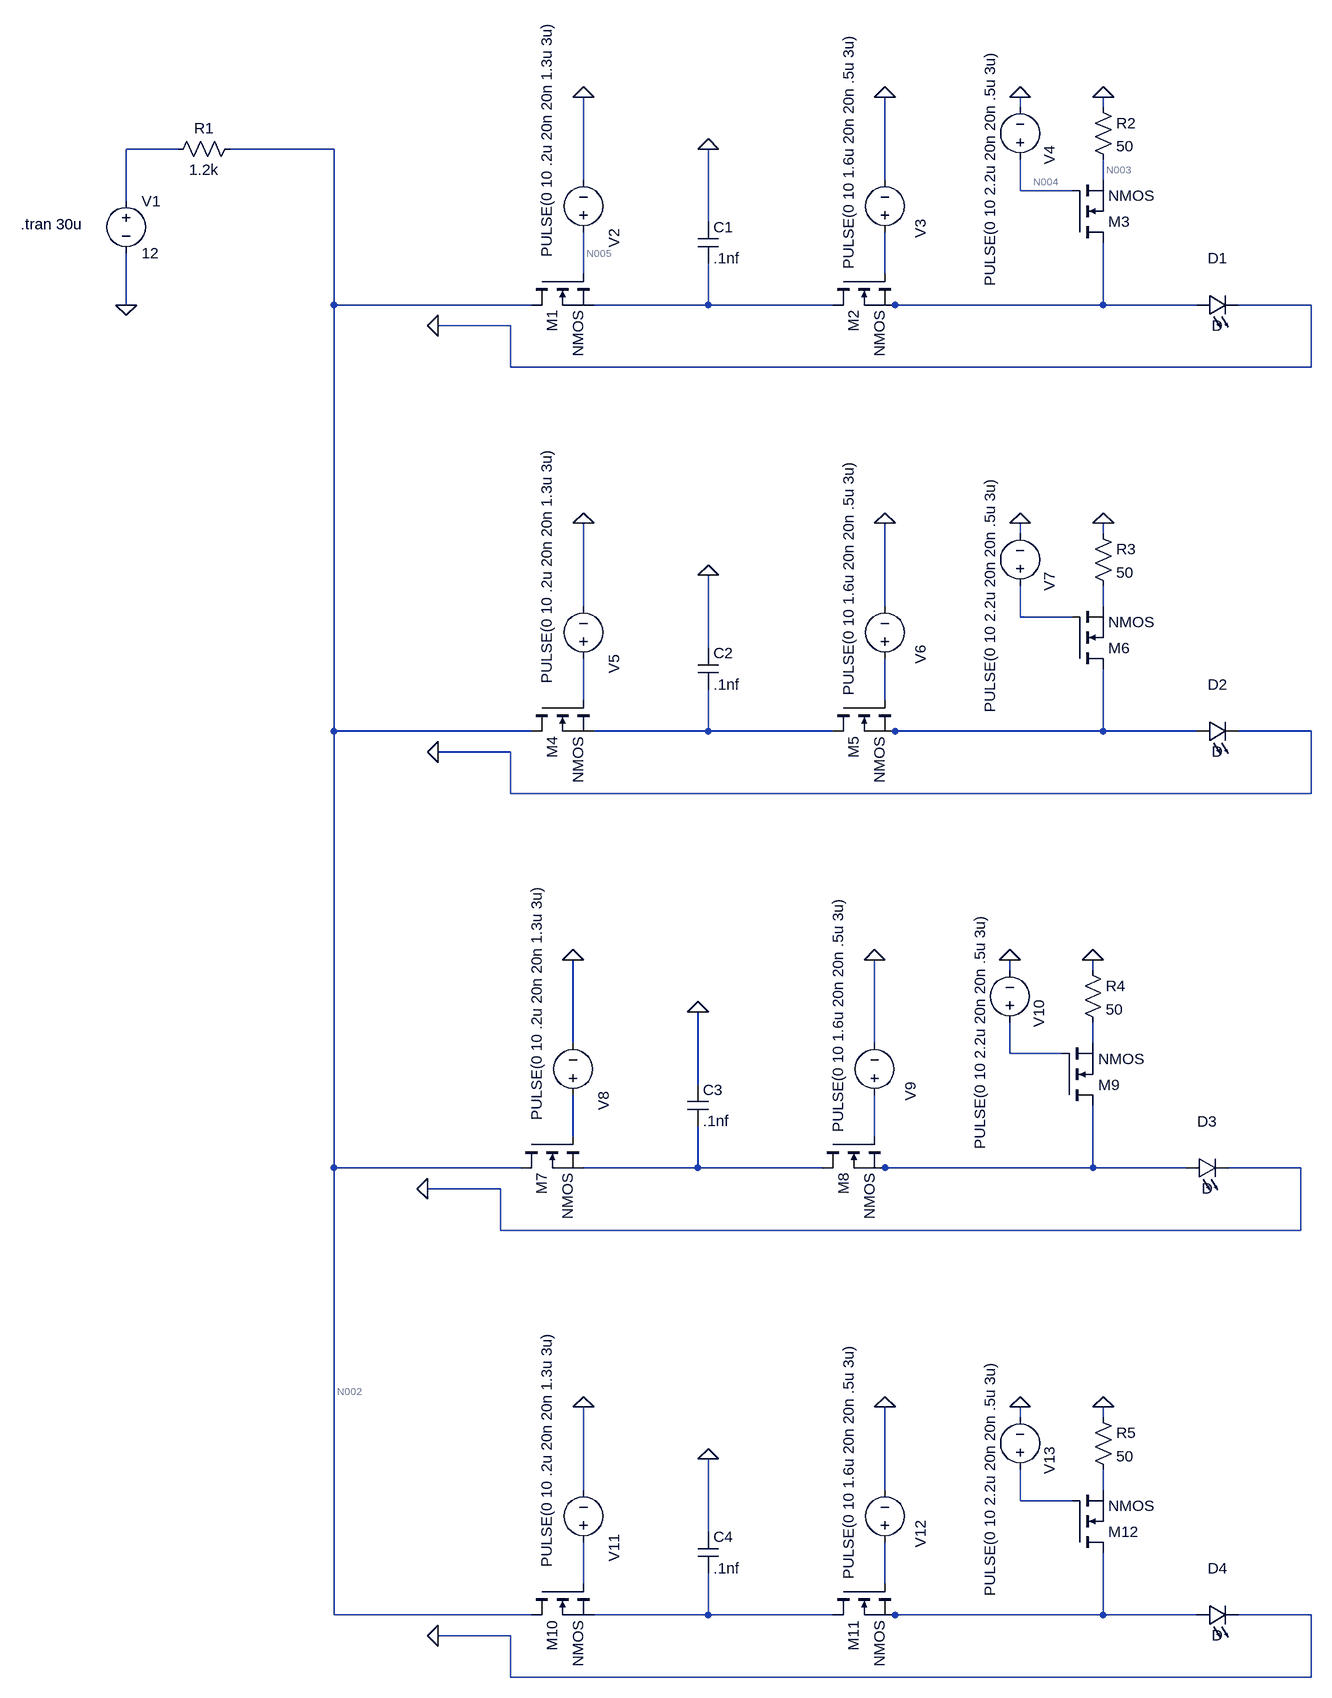
[diagram p0: schematic LEDpulser3.asc]
LEDpulser3.asc, the LTspice schematic file:
Version 4
SHEET 1 1444 2500
WIRE 976 80 976 64
WIRE 1104 80 1104 64
WIRE -320 144 -400 144
WIRE -80 144 -240 144
WIRE 304 192 304 64
WIRE 768 192 768 64
WIRE 1104 192 1104 160
WIRE 976 208 976 160
WIRE 1056 208 976 208
WIRE -400 224 -400 144
WIRE 496 256 496 144
WIRE 304 336 304 272
WIRE 768 336 768 272
WIRE -400 384 -400 304
WIRE -80 384 -80 144
WIRE 224 384 -80 384
WIRE 496 384 496 320
WIRE 496 384 320 384
WIRE 688 384 496 384
WIRE 784 384 768 384
WIRE 1104 384 1104 288
WIRE 1104 384 784 384
WIRE 1248 384 1104 384
WIRE 1424 384 1312 384
WIRE 192 416 80 416
WIRE 192 480 192 416
WIRE 1424 480 1424 384
WIRE 1424 480 192 480
WIRE 976 736 976 720
WIRE 1104 736 1104 720
WIRE 304 848 304 720
WIRE 768 848 768 720
WIRE 1104 848 1104 816
WIRE 976 864 976 816
WIRE 1056 864 976 864
WIRE 496 912 496 800
WIRE 304 992 304 928
WIRE 768 992 768 928
WIRE -80 1040 -80 384
WIRE 224 1040 -80 1040
WIRE 496 1040 496 976
WIRE 496 1040 320 1040
WIRE 688 1040 496 1040
WIRE 784 1040 768 1040
WIRE 1104 1040 1104 944
WIRE 1104 1040 784 1040
WIRE 1248 1040 1104 1040
WIRE 1424 1040 1312 1040
WIRE 192 1072 80 1072
WIRE 192 1136 192 1072
WIRE 1424 1136 1424 1040
WIRE 1424 1136 192 1136
WIRE 960 1408 960 1392
WIRE 1088 1408 1088 1392
WIRE 288 1520 288 1392
WIRE 752 1520 752 1392
WIRE 1088 1520 1088 1488
WIRE 960 1536 960 1488
WIRE 1040 1536 960 1536
WIRE 480 1584 480 1472
WIRE 288 1664 288 1600
WIRE 752 1664 752 1600
WIRE -80 1712 -80 1040
WIRE 208 1712 -80 1712
WIRE 480 1712 480 1648
WIRE 480 1712 304 1712
WIRE 672 1712 480 1712
WIRE 768 1712 752 1712
WIRE 1088 1712 1088 1616
WIRE 1088 1712 768 1712
WIRE 1232 1712 1088 1712
WIRE 1408 1712 1296 1712
WIRE 176 1744 64 1744
WIRE 176 1808 176 1744
WIRE 1408 1808 1408 1712
WIRE 1408 1808 176 1808
WIRE 976 2096 976 2080
WIRE 1104 2096 1104 2080
WIRE 304 2208 304 2080
WIRE 768 2208 768 2080
WIRE 1104 2208 1104 2176
WIRE 976 2224 976 2176
WIRE 1056 2224 976 2224
WIRE 496 2272 496 2160
WIRE 304 2352 304 2288
WIRE 768 2352 768 2288
WIRE -80 2400 -80 1712
WIRE 224 2400 -80 2400
WIRE 496 2400 496 2336
WIRE 496 2400 320 2400
WIRE 688 2400 496 2400
WIRE 784 2400 768 2400
WIRE 1104 2400 1104 2304
WIRE 1104 2400 784 2400
WIRE 1248 2400 1104 2400
WIRE 1424 2400 1312 2400
WIRE 192 2432 80 2432
WIRE 192 2496 192 2432
WIRE 1424 2496 1424 2400
WIRE 1424 2496 192 2496
FLAG 304 64 0
FLAG -400 384 0
FLAG 496 144 0
FLAG 768 64 0
FLAG 976 64 0
FLAG 1104 64 0
FLAG 304 720 0
FLAG 496 800 0
FLAG 768 720 0
FLAG 976 720 0
FLAG 1104 720 0
FLAG 288 1392 0
FLAG 480 1472 0
FLAG 752 1392 0
FLAG 960 1392 0
FLAG 1088 1392 0
FLAG 304 2080 0
FLAG 496 2160 0
FLAG 768 2080 0
FLAG 976 2080 0
FLAG 1104 2080 0
FLAG 80 416 0
FLAG 80 1072 0
FLAG 64 1744 0
FLAG 80 2432 0
SYMBOL voltage -400 208 R0
WINDOW 123 0 0 Left 0
WINDOW 39 0 0 Left 0
SYMATTR InstName V1
SYMATTR Value 12
SYMBOL voltage 304 288 R180
WINDOW 0 -63 7 VTop 2
WINDOW 3 72 159 VBottom 2
WINDOW 123 0 0 Left 0
WINDOW 39 0 0 Left 0
SYMATTR InstName V2
SYMATTR Value PULSE(0 10 .2u 20n 20n 1.3u 3u)
SYMBOL nmos 224 336 M90
SYMATTR InstName M1
SYMBOL res -224 128 R90
WINDOW 0 0 56 VBottom 2
WINDOW 3 32 56 VTop 2
SYMATTR InstName R1
SYMATTR Value 1.2k
SYMBOL cap 480 256 R0
SYMATTR InstName C1
SYMATTR Value .1nf
SYMBOL LED 1248 400 R270
WINDOW 0 72 32 VTop 2
WINDOW 3 0 32 VBottom 2
SYMATTR InstName D1
SYMBOL nmos 688 336 M90
SYMATTR InstName M2
SYMBOL voltage 768 288 R180
WINDOW 0 -55 7 VRight 2
WINDOW 3 56 -42 VRight 2
WINDOW 123 0 0 Left 0
WINDOW 39 0 0 Left 0
SYMATTR InstName V3
SYMATTR Value PULSE(0 10 1.6u 20n 20n .5u 3u)
SYMBOL nmos 1056 288 M180
SYMATTR InstName M3
SYMBOL res 1088 64 R0
SYMATTR InstName R2
SYMATTR Value 50
SYMBOL voltage 976 176 R180
WINDOW 0 -45 8 VRight 2
WINDOW 3 46 -180 VRight 2
WINDOW 123 0 0 Left 0
WINDOW 39 0 0 Left 0
SYMATTR InstName V4
SYMATTR Value PULSE(0 10 2.2u 20n 20n .5u 3u)
SYMBOL voltage 304 944 R180
WINDOW 0 -63 7 VTop 2
WINDOW 3 72 159 VBottom 2
WINDOW 123 0 0 Left 0
WINDOW 39 0 0 Left 0
SYMATTR InstName V5
SYMATTR Value PULSE(0 10 .2u 20n 20n 1.3u 3u)
SYMBOL nmos 224 992 M90
SYMATTR InstName M4
SYMBOL cap 480 912 R0
SYMATTR InstName C2
SYMATTR Value .1nf
SYMBOL LED 1248 1056 R270
WINDOW 0 72 32 VTop 2
WINDOW 3 0 32 VBottom 2
SYMATTR InstName D2
SYMBOL nmos 688 992 M90
SYMATTR InstName M5
SYMBOL voltage 768 944 R180
WINDOW 0 -55 7 VRight 2
WINDOW 3 56 -42 VRight 2
WINDOW 123 0 0 Left 0
WINDOW 39 0 0 Left 0
SYMATTR InstName V6
SYMATTR Value PULSE(0 10 1.6u 20n 20n .5u 3u)
SYMBOL nmos 1056 944 M180
SYMATTR InstName M6
SYMBOL res 1088 720 R0
SYMATTR InstName R3
SYMATTR Value 50
SYMBOL voltage 976 832 R180
WINDOW 0 -45 8 VRight 2
WINDOW 3 46 -180 VRight 2
WINDOW 123 0 0 Left 0
WINDOW 39 0 0 Left 0
SYMATTR InstName V7
SYMATTR Value PULSE(0 10 2.2u 20n 20n .5u 3u)
SYMBOL voltage 288 1616 R180
WINDOW 0 -63 7 VTop 2
WINDOW 3 72 159 VBottom 2
WINDOW 123 0 0 Left 0
WINDOW 39 0 0 Left 0
SYMATTR InstName V8
SYMATTR Value PULSE(0 10 .2u 20n 20n 1.3u 3u)
SYMBOL nmos 208 1664 M90
SYMATTR InstName M7
SYMBOL cap 464 1584 R0
SYMATTR InstName C3
SYMATTR Value .1nf
SYMBOL LED 1232 1728 R270
WINDOW 0 72 32 VTop 2
WINDOW 3 0 32 VBottom 2
SYMATTR InstName D3
SYMBOL nmos 672 1664 M90
SYMATTR InstName M8
SYMBOL voltage 752 1616 R180
WINDOW 0 -55 7 VRight 2
WINDOW 3 56 -42 VRight 2
WINDOW 123 0 0 Left 0
WINDOW 39 0 0 Left 0
SYMATTR InstName V9
SYMATTR Value PULSE(0 10 1.6u 20n 20n .5u 3u)
SYMBOL nmos 1040 1616 M180
SYMATTR InstName M9
SYMBOL res 1072 1392 R0
SYMATTR InstName R4
SYMATTR Value 50
SYMBOL voltage 960 1504 R180
WINDOW 0 -45 8 VRight 2
WINDOW 3 46 -180 VRight 2
WINDOW 123 0 0 Left 0
WINDOW 39 0 0 Left 0
SYMATTR InstName V10
SYMATTR Value PULSE(0 10 2.2u 20n 20n .5u 3u)
SYMBOL voltage 304 2304 R180
WINDOW 0 -63 7 VTop 2
WINDOW 3 72 159 VBottom 2
WINDOW 123 0 0 Left 0
WINDOW 39 0 0 Left 0
SYMATTR InstName V11
SYMATTR Value PULSE(0 10 .2u 20n 20n 1.3u 3u)
SYMBOL nmos 224 2352 M90
SYMATTR InstName M10
SYMBOL cap 480 2272 R0
SYMATTR InstName C4
SYMATTR Value .1nf
SYMBOL LED 1248 2416 R270
WINDOW 0 72 32 VTop 2
WINDOW 3 0 32 VBottom 2
SYMATTR InstName D4
SYMBOL nmos 688 2352 M90
SYMATTR InstName M11
SYMBOL voltage 768 2304 R180
WINDOW 0 -55 7 VRight 2
WINDOW 3 56 -42 VRight 2
WINDOW 123 0 0 Left 0
WINDOW 39 0 0 Left 0
SYMATTR InstName V12
SYMATTR Value PULSE(0 10 1.6u 20n 20n .5u 3u)
SYMBOL nmos 1056 2304 M180
SYMATTR InstName M12
SYMBOL res 1088 2080 R0
SYMATTR InstName R5
SYMATTR Value 50
SYMBOL voltage 976 2192 R180
WINDOW 0 -45 8 VRight 2
WINDOW 3 46 -180 VRight 2
WINDOW 123 0 0 Left 0
WINDOW 39 0 0 Left 0
SYMATTR InstName V13
SYMATTR Value PULSE(0 10 2.2u 20n 20n .5u 3u)
TEXT -562 260 Left 2 !.tran 30u

The netlist it stands for:
* LEDpulser3.asc
V1 N001 0 12
V2 N005 0 PULSE(0 10 .2u 20n 20n 1.3u 3u)
M1 N002 N005 N007 N007 NMOS
R1 N002 N001 1.2k
C1 0 N007 .1nf
D1 N008 0 D
M2 N007 N006 N008 N008 NMOS
V3 N006 0 PULSE(0 10 1.6u 20n 20n .5u 3u)
M3 N008 N004 N003 N003 NMOS
R2 0 N003 50
V4 N004 0 PULSE(0 10 2.2u 20n 20n .5u 3u)
V5 N011 0 PULSE(0 10 .2u 20n 20n 1.3u 3u)
M4 N002 N011 N013 N013 NMOS
C2 0 N013 .1nf
D2 N014 0 D
M5 N013 N012 N014 N014 NMOS
V6 N012 0 PULSE(0 10 1.6u 20n 20n .5u 3u)
M6 N014 N010 N009 N009 NMOS
R3 0 N009 50
V7 N010 0 PULSE(0 10 2.2u 20n 20n .5u 3u)
V8 N017 0 PULSE(0 10 .2u 20n 20n 1.3u 3u)
M7 N002 N017 N019 N019 NMOS
C3 0 N019 .1nf
D3 N020 0 D
M8 N019 N018 N020 N020 NMOS
V9 N018 0 PULSE(0 10 1.6u 20n 20n .5u 3u)
M9 N020 N016 N015 N015 NMOS
R4 0 N015 50
V10 N016 0 PULSE(0 10 2.2u 20n 20n .5u 3u)
V11 N023 0 PULSE(0 10 .2u 20n 20n 1.3u 3u)
M10 N002 N023 N025 N025 NMOS
C4 0 N025 .1nf
D4 N026 0 D
M11 N025 N024 N026 N026 NMOS
V12 N024 0 PULSE(0 10 1.6u 20n 20n .5u 3u)
M12 N026 N022 N021 N021 NMOS
R5 0 N021 50
V13 N022 0 PULSE(0 10 2.2u 20n 20n .5u 3u)
.model D D
.lib standard.dio
.model NMOS NMOS
.model PMOS PMOS
.lib standard.mos
.tran 30u
.backanno
.end

* Results of the author's LTspice run, read from the files saved beside the schematic
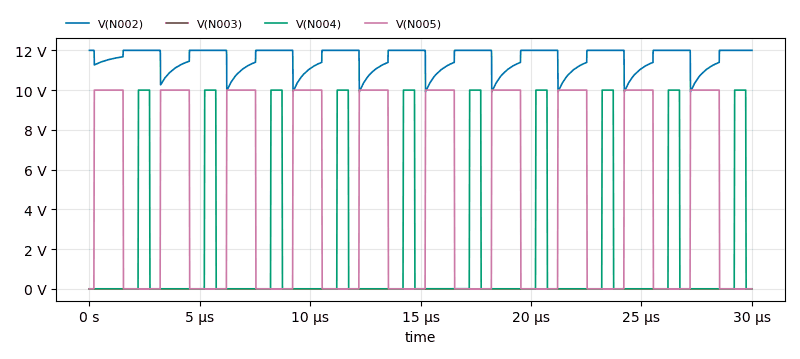
[diagram p1: Transient Analysis of LEDpulser3.asc, plotted from the saved traces]
* Transient Analysis, 1 run:
*   V(N002): min 9.911 V, max 12 V, average 11.54 V, rms 11.56 V, last 12 V
*   V(N003): min -96.23 pV, max 397.6 pV, average 85.11 pV, rms 149.9 pV, last 17.02 pV
*   V(N004): min 0 V, max 10 V, average 1.733 V, rms 4.152 V, last 0 V
*   V(N005): min 0 V, max 10 V, average 4.4 V, rms 6.618 V, last 0 V